# EAGLE design hard war (EAGLE 9.6.2)
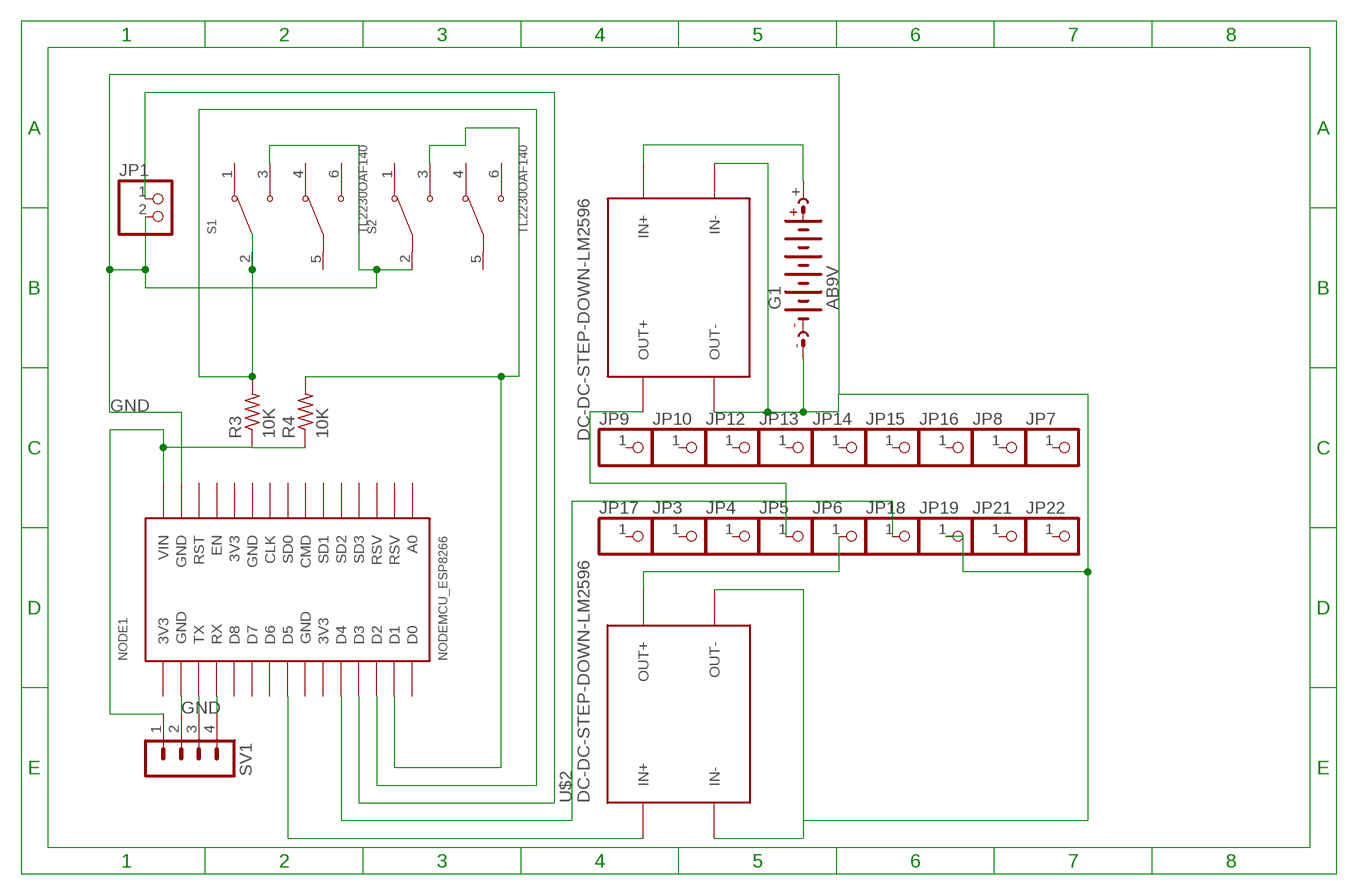
[diagram p0: schematic, sheet 1]

## Parts
G1  AB9V  [AB9V]
JP1  PINHD-1X2  [1X02]
JP3  PINHD-1X1  [1X01]
JP4  PINHD-1X1  [1X01]
JP5  PINHD-1X1  [1X01]
JP6  PINHD-1X1  [1X01]
JP7  PINHD-1X1  [1X01]
JP8  PINHD-1X1  [1X01]
JP9  PINHD-1X1  [1X01]
JP10  PINHD-1X1  [1X01]
JP12  PINHD-1X1  [1X01]
JP13  PINHD-1X1  [1X01]
JP14  PINHD-1X1  [1X01]
JP15  PINHD-1X1  [1X01]
JP16  PINHD-1X1  [1X01]
JP17  PINHD-1X1  [1X01]
JP18  PINHD-1X1  [1X01]
JP19  PINHD-1X1  [1X01]
JP21  PINHD-1X1  [1X01]
JP22  PINHD-1X1  [1X01]
NODE1  NODEMCU_ESP8266  [NODEMCU_ESP8266]
R3  10K  R-US_0204/7  [0204/7]
R4  10K  R-US_0204/7  [0204/7]
S1  TL2230OAF140  [SW_TL2230OAF140]
S2  TL2230OAF140  [SW_TL2230OAF140]
SV1  MA04-1  [MA04-1]
U$1  DC-DC-STEP-DOWN-LM2596  [DC-DC-STEP-DOWN-LM2596]
U$2  DC-DC-STEP-DOWN-LM2596  [DC-DC-STEP-DOWN-LM2596]

## Nets
GND: G1.- JP1.2 JP19.1 NODE1.GND@1(GND) NODE1.GND@4(GND) S1.3(NO1) S2.2(COM1) SV1.2 U$1.IN- U$1.OUT- U$2.IN- U$2.OUT-
N$2: NODE1.TX SV1.3
N$3: NODE1.RX SV1.4
N$4: JP6.1 U$2.OUT+
N$5: JP5.1 U$1.OUT+
N$6: NODE1.D2 R3.2 S1.2(COM1)
N$7: NODE1.D5 U$2.IN+
N$8: G1.+ U$1.IN+
N$9: JP18.1 NODE1.D4
N$10: NODE1.VIN R3.1 R4.1 SV1.1
N$12: JP1.1 NODE1.D3
N$16: NODE1.D1 R4.2 S2.3(NO1)
Unconnected: JP3.1 JP4.1 JP7.1 JP8.1 JP9.1 JP10.1 JP12.1 JP13.1 JP14.1 JP15.1 JP16.1 JP17.1 JP21.1 JP22.1 NODE1.A0 NODE1.CLK NODE1.CMD NODE1.D0 NODE1.D6 NODE1.D7 NODE1.D8 NODE1.EN NODE1.RST NODE1.RSV1(RSV) NODE1.RSV2(RSV) NODE1.SD1 NODE1.SD2 NODE1.SD3 NODE1.SDO(SD0) S1.1(NC1) S1.4(NC2) S1.5(COM2) S1.6(NO2) S2.1(NC1) S2.4(NC2) S2.5(COM2) S2.6(NO2)

## Power pins joined to a net without a drawn wire
3V3: NODE1.3V3@1(3V3) NODE1.3V3@2(3V3) NODE1.3V3@3(3V3)
GND: NODE1.GND@2(GND) NODE1.GND@3(GND)

## Library data of the parts
G1 = battery:AB9V: 9-V BATTERY CLIP
JP1 = pinhead:PINHD-1X2: PIN HEADER
JP3-JP10 JP12-JP19 JP21 JP22 = pinhead:PINHD-1X1: PIN HEADER
NODE1 = nodemcu_esp8266:NODEMCU_ESP8266: Node MCU V2 (ESP8266) Created by Harish
R3 R4 = rcl:R-US_: RESISTOR, American symbol; SPICEPREFIX: R
S1 S2 = TL2230OAF140:TL2230OAF140: Check availability <https://pricing.snapeda.com/parts/TL2230OAF140/E-Switch/view-part?ref=eda>; AVAILABILITY: In Stock; CHECK_PRICES: https://www.snapeda.com/parts/TL2230OAF140/E-Switch/view-part/?ref=eda; DESCRIPTION: Pushbutton Switch DPDT Standard Through Hole; MF: E-Switch; MP: TL2230OAF140; PACKAGE: None; PRICE: None; PURCHASE-URL: https://www.snapeda.com/api/url_track_click_mouser/?unipart_id=2752784&manufacturer=E-Switch&part_name=TL2230OAF140&search_term=None; SNAPEDA_LINK: https://www.snapeda.com/parts/TL2230OAF140/E-Switch/view-part/?ref=snap
SV1 = con-lstb:MA04-1: PIN HEADER; OC_FARNELL: unknown; OC_NEWARK: unknown
U$1 U$2 = diy-modules:DC-DC-STEP-DOWN-LM2596: DC/DC Step-Down Regulator based on LM2596-ADJ chip

## Board
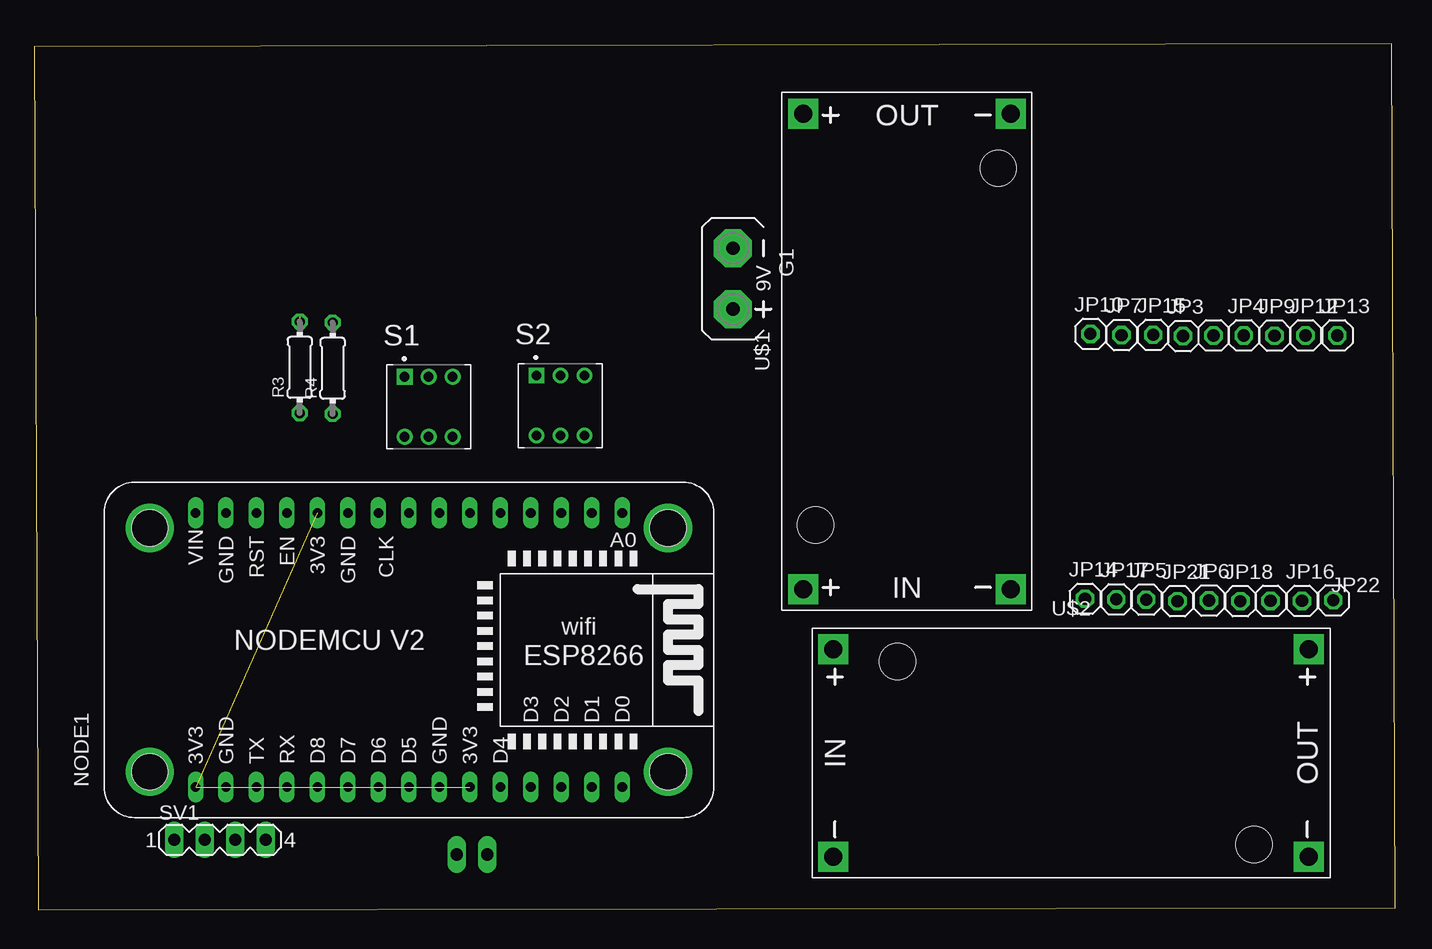
[diagram p1: board, top side]
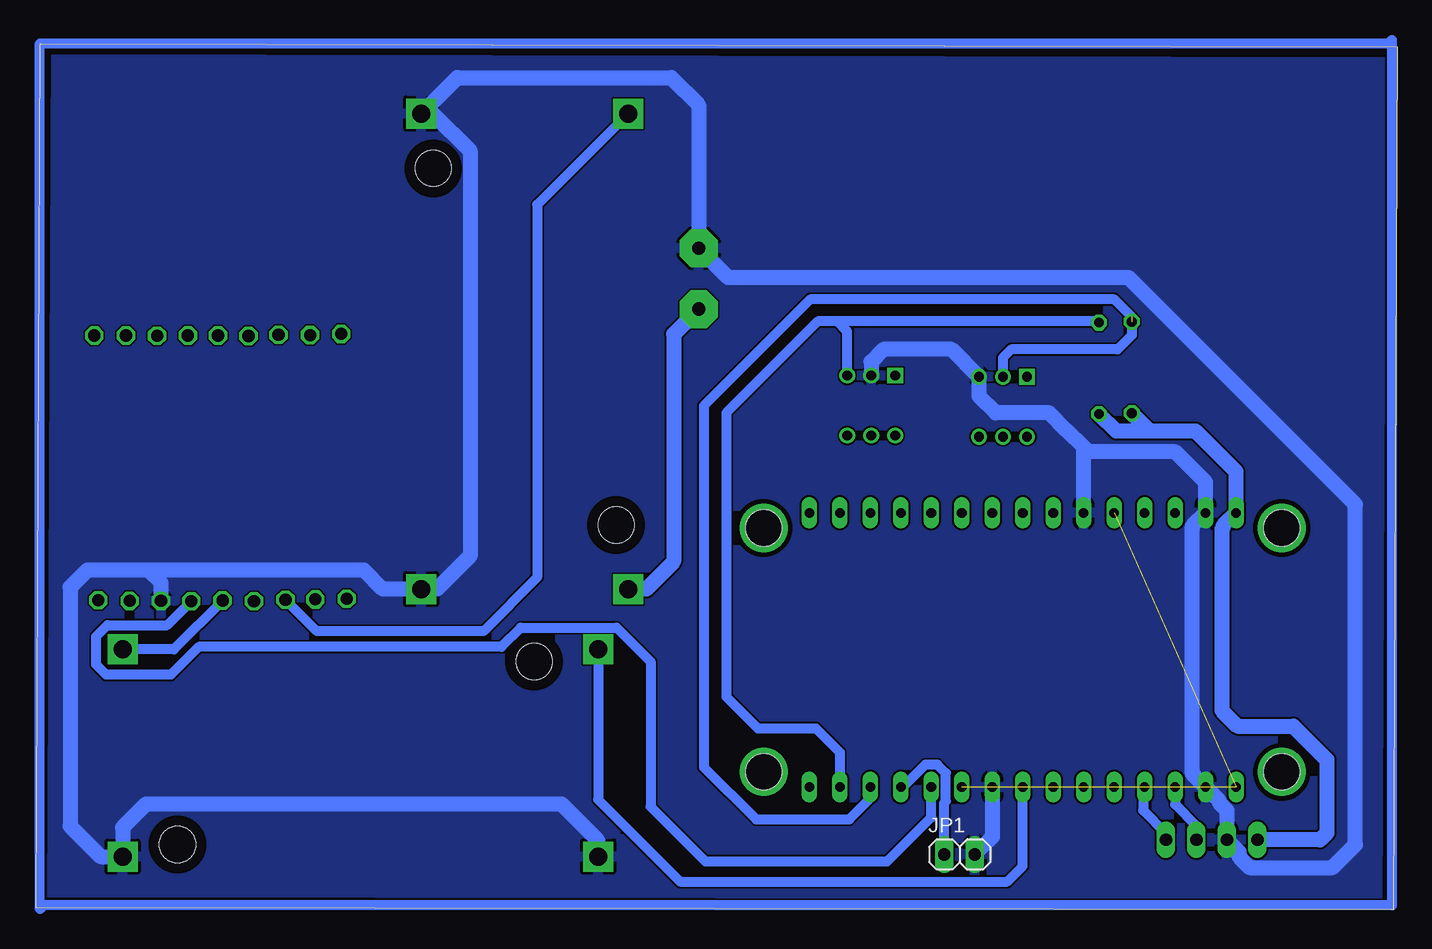
[diagram p2: board, bottom side, seen from below]

Size 113.41 x 72.18 mm. Coordinates in mm from the lower left corner, seen from the top.
Outline: 0.33,0 113.41,0.2 113.11,72.18 0,71.95 0.33,0
Copper layers (1*16): Top 0.035mm / dielectric 1.5mm / Bottom 0.035mm
Design rules "default *": minimum track width 6mil, minimum drill 0.35mm, track to track 6mil, track to pad 6mil, pad to pad 6mil, via to via 6mil, smd to smd 6mil, copper to edge 35mil, drill to drill 6mil, minimum pad ring 10mil, minimum via ring 8mil, stop-mask expansion 4mil, vias tented up to drill 0mil, thermal gap 10mil

### Footprints (pad centres in the part's own frame; a part is rotated, then mirrored left to right if it is on the bottom)
AB9V = drill 1.118 pad 3.15 octagon: + 0,2.54; - 0,-2.54
1X02 = drill 1.016 long: 1 -1.27,0; 2 1.27,0
1X01 = drill 1.016 octagon: 1 0,0
NODEMCU_ESP8266 = drill 0.8 long: 3V3@1 -11.43,19.05; 3V3@2 -11.43,-3.81; 3V3@3 11.43,8.89; A0 11.43,-16.51; CLK 11.43,3.81; CMD 11.43,-1.27; D0 -11.43,-16.51; D1 -11.43,-13.97; D2 -11.43,-11.43; D3 -11.43,-8.89; D4 -11.43,-6.35; D5 -11.43,1.27; D6 -11.43,3.81; D7 -11.43,6.35; D8 -11.43,8.89; EN 11.43,11.43; GND@1 -11.43,16.51; GND@2 -11.43,-1.27; GND@3 11.43,6.35; GND@4 11.43,16.51; RST 11.43,13.97; RSV1 11.43,-11.43; RSV2 11.43,-13.97; RX -11.43,11.43; SD1 11.43,-3.81; SD2 11.43,-6.35; SD3 11.43,-8.89; SDO 11.43,1.27; TX -11.43,13.97; VIN 11.43,19.05 | drill 3: P$31 10.16,22.86; P$32 -10.16,22.86; P$33 -10.16,-20.32; P$34 10.16,-20.32 | hole 3: 10.16,22.86; 10.16,-20.32; -10.16,-20.32; -10.16,22.86
0204/7 = drill 0.813 octagon: 1 -3.81,0; 2 3.81,0
SW_TL2230OAF140 = drill 0.8 square: 1 -2,2.5 | drill 0.8: 2 0,2.5; 3 2,2.5; 4 -2,-2.5; 5 0,-2.5; 6 2,-2.5
MA04-1 = drill 1.016 long: 1 -3.81,0; 2 -1.27,0; 3 1.27,0; 4 3.81,0
DC-DC-STEP-DOWN-LM2596 = drill 1.5 pad 2.5 square: IN+ -19.812,8.636; IN- -19.812,-8.636; OUT+ 19.812,8.636; OUT- 19.812,-8.636 | hole 3: -14.478,7.62; 15.24,-7.62

### Placement (x,y rotation side)
G1  58.22,52.6 180 top
JP1  36.47,4.62 0 bottom
JP3  95.73,47.83 0 top
JP4  100.79,47.88 0 top
JP5  92.66,25.86 0 top
JP6  97.89,25.78 0 top
JP7  90.6,47.9 0 top
JP8  98.27,47.88 0 top
JP9  103.35,47.85 0 top
JP10  88.01,48.01 0 top
JP12  105.94,47.88 0 top
JP13  108.59,47.88 0 top
JP14  87.55,25.93 0 top
JP15  93.24,47.93 0 top
JP16  105.64,25.76 0 top
JP17  90.17,25.88 0 top
JP18  100.51,25.73 0 top
JP19  103.02,25.76 0 top
JP21  95.28,25.73 0 top
JP22  108.25,25.81 0 top
NODE1  32.49,21.67 90 top
R3  22.12,45.21 90 top
R4  24.87,45.14 90 top
S1  32.87,41.94 0 top
S2  43.84,42.04 0 top
SV1  15.47,5.84 0 top
U$1  72.72,46.56 90 top
U$2  86.41,13.08 0 top

### Tracks (layer width: path | path; a pad name or v marks a point on that pad's centre or on a via)
3V3  (2 unrouted)
GND  (1 unrouted)
  Bottom 1.27: NODE1.GND@2 33.76,6.07 JP1.2 | JP19.1 103.02,27.25 104.09,28.32 | U$2.IN- 66.6,5.77 69.65,8.81 104.29,8.81 106.22,6.88 U$2.OUT- 108.05,4.44 110.59,6.98 110.59,26.9 109.17,28.32 104.09,28.32 | 104.09,28.32 86.11,28.32 84.53,26.75 U$1.IN- 80.04,26.75 77.27,29.51 77.27,63.27 80.37,66.37 U$1.OUT- 78.36,69.37 60.5,69.37 58.22,67.08 G1.- 55.78,52.7 22.4,52.7 3.51,33.81 3.51,5.43 5.41,3.53 12.3,3.53 13.21,4.44 13.21,4.85 SV1.2 14.2,8.31 14.88,8.99 14.88,9.14 NODE1.GND@1 17.08,11.33 17.08,11.49 17.12,11.53 17.12,31.8 17.08,31.85 17.08,32 NODE1.GND@4 15.98,35.66 18.49,38.18 25.76,38.18 26.14,38.56 | S2.2 43.84,45.69 42.82,46.71 37.14,46.71 S1.3 34.87,42.82 33.48,41.43 29.01,41.43 27.53,39.95 26.14,38.56 | NODE1.GND@3 26.14,38.56
  pour Bottom: 0.36,71.81 0.36,0.48 0.76,0.08 113.13,0.08 113.23,-0.03 113.23,71.81 113.44,72.01 0.56,72.01
N$1
  Bottom 0.813: 0.46,72.21 0.46,0.38 112.83,0.38 113.13,0.08 113.13,72.21 0.76,72.21 0.46,72.52
N$2
  Bottom 0.813: NODE1.TX 18.52,8.79 16.74,7.01 SV1.3
N$3
  Bottom 0.813: NODE1.RX 21.18,10.11 21.18,8.31 19.28,6.4 SV1.4
N$4
  Bottom 0.813: JP6.1 101.96,21.72 U$2.OUT+
N$5
  Bottom 0.813: U$1.OUT+ 71.68,58.78 71.68,27.71 76.15,23.24 90.04,23.24 JP5.1
N$6  (1 unrouted)
  Bottom 0.813: 22.12,49.43 23.57,50.88 48.92,50.88 57.78,42.01 57.78,11.89 53.44,7.54 45.67,7.54 43.79,9.42 43.79,10.11 NODE1.D2 | R3.2 22.12,47.9 23.32,46.71 32.16,46.71 32.87,46 S1.2
N$7
  Bottom 0.813: U$2.IN+ 66.6,9.19 59.77,2.36 32.51,2.36 31.22,3.66 NODE1.D5
N$8
  Bottom 1.27: G1.+ 60.3,47.98 60.3,29.03 62.59,26.75 U$1.IN+
N$9
  Bottom 0.813: NODE1.D4 38.84,7.72 42.52,4.04 57.66,4.04 62.23,8.61 62.23,20.7 65.05,23.53 73.06,23.53 74.67,21.92 99.88,21.92 102.2,19.6 107.6,19.6 108.44,20.44 108.44,22.79 107.5,23.73 102.51,23.73 JP18.1
N$10
  Bottom 1.27: 20.62,39.9 R3.1 | SV1.1 6.43,5.84 5.87,6.4 5.87,12.52 8.66,15.32 13.33,15.32 14.63,16.61 14.63,31.75 14.54,31.85 14.54,32 NODE1.VIN 13.44,36.53 16.81,39.9 20.62,39.9 | 20.62,39.9 23.44,39.9 R4.1
N$12
  Bottom 0.813: JP1.1 37.74,8.96 37.62,9.08 37.62,11.39 38.33,12.1 39.34,12.1 41.21,10.24 NODE1.D3
N$16
  Bottom 0.813: NODE1.D1 46.46,13.13 48.46,15.14 53.29,15.14 55.91,17.75 55.91,41.43 48.29,49.05 46.69,49.05 | R4.2 24.97,49.05 46.69,49.05 | S2.3 45.84,48.2 46.69,49.05